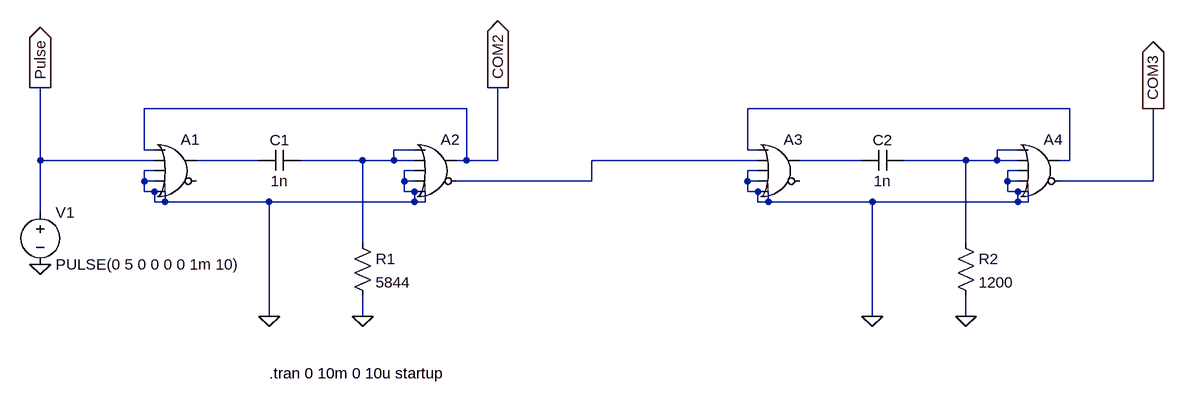
[diagram p0: schematic Multivibrateur-stable-OR.asc]
Multivibrateur-stable-OR.asc, the LTspice schematic file:
Version 4.1
SHEET 1 1660 680
WIRE 512 48 16 48
WIRE 1440 48 944 48
WIRE 16 112 16 48
WIRE 32 112 16 112
WIRE 432 112 400 112
WIRE 944 112 944 48
WIRE 960 112 944 112
WIRE 1360 112 1328 112
WIRE -144 128 -144 16
WIRE 32 128 -144 128
WIRE 192 128 96 128
WIRE 352 128 256 128
WIRE 400 128 400 112
WIRE 400 128 352 128
WIRE 432 128 400 128
WIRE 512 128 512 48
WIRE 512 128 496 128
WIRE 560 128 560 16
WIRE 560 128 512 128
WIRE 960 128 704 128
WIRE 1120 128 1024 128
WIRE 1280 128 1184 128
WIRE 1328 128 1328 112
WIRE 1328 128 1280 128
WIRE 1360 128 1328 128
WIRE 1440 128 1440 48
WIRE 1440 128 1424 128
WIRE 32 144 16 144
WIRE 432 144 416 144
WIRE 960 144 944 144
WIRE 1360 144 1344 144
WIRE 16 160 16 144
WIRE 32 160 16 160
WIRE 416 160 416 144
WIRE 432 160 416 160
WIRE 704 160 704 128
WIRE 704 160 496 160
WIRE 944 160 944 144
WIRE 960 160 944 160
WIRE 1344 160 1344 144
WIRE 1360 160 1344 160
WIRE 1568 160 1568 48
WIRE 1568 160 1424 160
WIRE 16 176 16 160
WIRE 32 176 16 176
WIRE 416 176 416 160
WIRE 432 176 416 176
WIRE 944 176 944 160
WIRE 960 176 944 176
WIRE 1344 176 1344 160
WIRE 1360 176 1344 176
WIRE 32 192 32 176
WIRE 48 192 48 176
WIRE 48 192 32 192
WIRE 208 192 48 192
WIRE 432 192 432 176
WIRE 432 192 208 192
WIRE 448 192 448 176
WIRE 448 192 432 192
WIRE 960 192 960 176
WIRE 976 192 976 176
WIRE 976 192 960 192
WIRE 1136 192 976 192
WIRE 1360 192 1360 176
WIRE 1360 192 1136 192
WIRE 1376 192 1376 176
WIRE 1376 192 1360 192
WIRE -144 208 -144 128
WIRE 352 256 352 128
WIRE 1280 256 1280 128
WIRE 208 368 208 192
WIRE 352 368 352 336
WIRE 1136 368 1136 192
WIRE 1280 368 1280 336
FLAG 208 368 0
FLAG 352 368 0
FLAG 1136 368 0
FLAG 1280 368 0
FLAG 560 16 COM2
IOPIN 560 16 Out
FLAG 1568 48 COM3
IOPIN 1568 48 Out
FLAG -144 16 Pulse
IOPIN -144 16 Out
FLAG -144 288 0
SYMBOL Digital\\or 64 80 R0
WINDOW 3 -8 36 Invisible 2
SYMATTR Value Vhigh=5 Vlow=0 Ref=2.5 td=5ns
SYMATTR InstName A1
SYMBOL Digital\\or 464 80 R0
WINDOW 3 -8 128 Invisible 2
SYMATTR Value Vhigh=5 Vlow=0 Ref=2.5 td=5ns
SYMATTR InstName A2
SYMBOL cap 256 112 R90
WINDOW 0 0 32 VBottom 2
WINDOW 3 32 32 VTop 2
SYMATTR InstName C1
SYMATTR Value 1n
SYMBOL res 336 240 R0
SYMATTR InstName R1
SYMATTR Value 5844
SYMBOL Digital\\or 992 80 R0
WINDOW 3 -8 36 Invisible 2
SYMATTR Value Vhigh=5 Vlow=0 Ref=2.5 td=5ns
SYMATTR InstName A3
SYMBOL Digital\\or 1392 80 R0
WINDOW 3 -8 128 Invisible 2
SYMATTR Value Vhigh=5 Vlow=0 Ref=2.5 td=5ns
SYMATTR InstName A4
SYMBOL cap 1184 112 R90
WINDOW 0 0 32 VBottom 2
WINDOW 3 32 32 VTop 2
SYMATTR InstName C2
SYMATTR Value 1n
SYMBOL res 1264 240 R0
SYMATTR InstName R2
SYMATTR Value 1200
SYMBOL voltage -144 192 R0
WINDOW 123 0 0 Left 0
WINDOW 39 0 0 Left 0
SYMATTR InstName V1
SYMATTR Value PULSE(0 5 0 0 0 0 1m 10)
TEXT 208 456 Left 2 !.tran 0 10m 0 10u startup

The netlist it stands for:
* Multivibrateur-stable-OR.asc
A1 COM2 Pulse 0 0 0 0 N004 0 OR Vhigh=5 Vlow=0 Ref=2.5 td=5ns
A2 N002 N002 0 0 0 N005 COM2 0 OR Vhigh=5 Vlow=0 Ref=2.5 td=5ns
C1 N002 N004 1n
R1 N002 0 5844
A3 N001 N005 0 0 0 0 N006 0 OR Vhigh=5 Vlow=0 Ref=2.5 td=5ns
A4 N003 N003 0 0 0 COM3 N001 0 OR Vhigh=5 Vlow=0 Ref=2.5 td=5ns
C2 N003 N006 1n
R2 N003 0 1200
V1 Pulse 0 PULSE(0 5 0 0 0 0 1m 10)
.tran 0 10m 0 10u startup
.backanno
.end